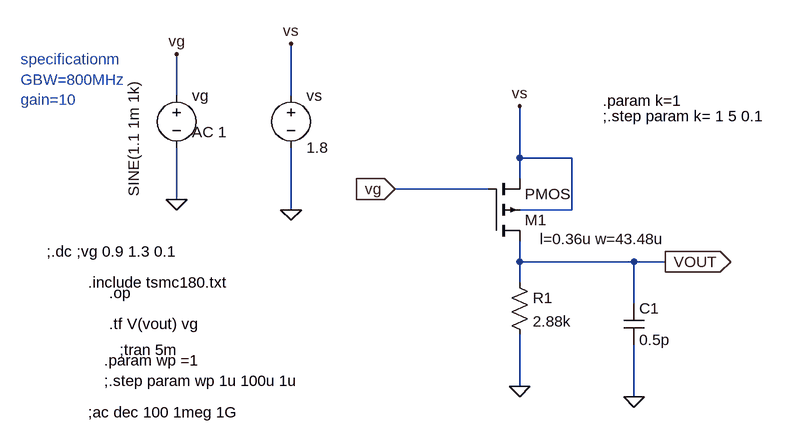
[diagram p0: schematic CS_AMP_PMOS_GBW=800MHz - Copy.asc]
CS_AMP_PMOS_GBW=800MHz - Copy.asc, the LTspice schematic file:
Version 4
SHEET 1 1124 680
WIRE 192 112 192 48
WIRE 368 112 368 32
WIRE 720 208 720 128
WIRE 800 208 720 208
WIRE 720 240 720 208
WIRE 672 256 528 256
WIRE 192 272 192 192
WIRE 368 288 368 192
WIRE 800 288 800 208
WIRE 800 288 720 288
WIRE 720 368 720 336
WIRE 896 368 720 368
WIRE 944 368 896 368
WIRE 720 400 720 368
WIRE 896 432 896 368
WIRE 720 560 720 480
WIRE 896 576 896 496
FLAG 192 272 0
FLAG 368 288 0
FLAG 192 48 vg
FLAG 368 32 vs
FLAG 528 256 vg
IOPIN 528 256 In
FLAG 720 128 vs
FLAG 944 368 VOUT
IOPIN 944 368 Out
FLAG 896 576 0
FLAG 720 560 0
DATAFLAG 576 256 ""
DATAFLAG 576 256 ""
DATAFLAG 720 368 ""
SYMBOL voltage 192 96 R0
WINDOW 3 -66 -7 VRight 2
WINDOW 123 24 72 Left 2
WINDOW 39 0 0 Left 0
SYMATTR Value SINE(1.1 1m 1k)
SYMATTR Value2 AC 1
SYMATTR InstName vg
SYMBOL voltage 368 96 R0
WINDOW 123 0 0 Left 0
WINDOW 39 0 0 Left 0
SYMATTR InstName vs
SYMATTR Value 1.8
SYMBOL pmos4 672 336 M180
WINDOW 123 79 3 Left 2
SYMATTR Value2 l=0.36u w=43.48u
SYMATTR InstName M1
SYMBOL res 704 384 R0
SYMATTR InstName R1
SYMATTR Value 2.88k
SYMBOL cap 880 432 R0
SYMATTR InstName C1
SYMATTR Value 0.5p
TEXT 56 400 Left 2 !.include tsmc180.txt
TEXT 88 416 Left 2 !.op
TEXT 88 464 Left 2 !.tf V(vout) vg
TEXT 56 600 Left 2 !;ac dec 100 1meg 1G
TEXT -48 56 Left 2 ;specificationm\nGBW=800MHz\ngain=10
TEXT 80 520 Left 2 !.param wp =1\n;.step param wp 1u 100u 1u
TEXT 848 120 Left 2 !.param k=1
TEXT 848 144 Left 2 !;.step param k= 1 5 0.1
TEXT -8 352 Left 2 !;.dc ;vg 0.9 1.3 0.1
TEXT 104 504 Left 2 !;tran 5m

The netlist it stands for:
* CS_AMP_PMOS_GBW=800MHz - Copy.asc
vg vg 0 SINE(1.1 1m 1k) AC 1
vs vs 0 1.8
M1 VOUT vg vs vs PMOS l=0.36u w=43.48u
R1 VOUT 0 2.88k
C1 VOUT 0 0.5p
.model NMOS NMOS
.model PMOS PMOS
.lib standard.mos
.include tsmc180.txt
.op
.tf V(vout) vg
;ac dec 100 1meg 1G
* specificationm
* GBW=800MHz
* gain=10
.param wp =1
;.step param wp 1u 100u 1u
.param k=1
;.step param k= 1 5 0.1
;.dc ;vg 0.9 1.3 0.1
;tran 5m
.backanno
.end